# EAGLE design REL8 (EAGLE 5.06)
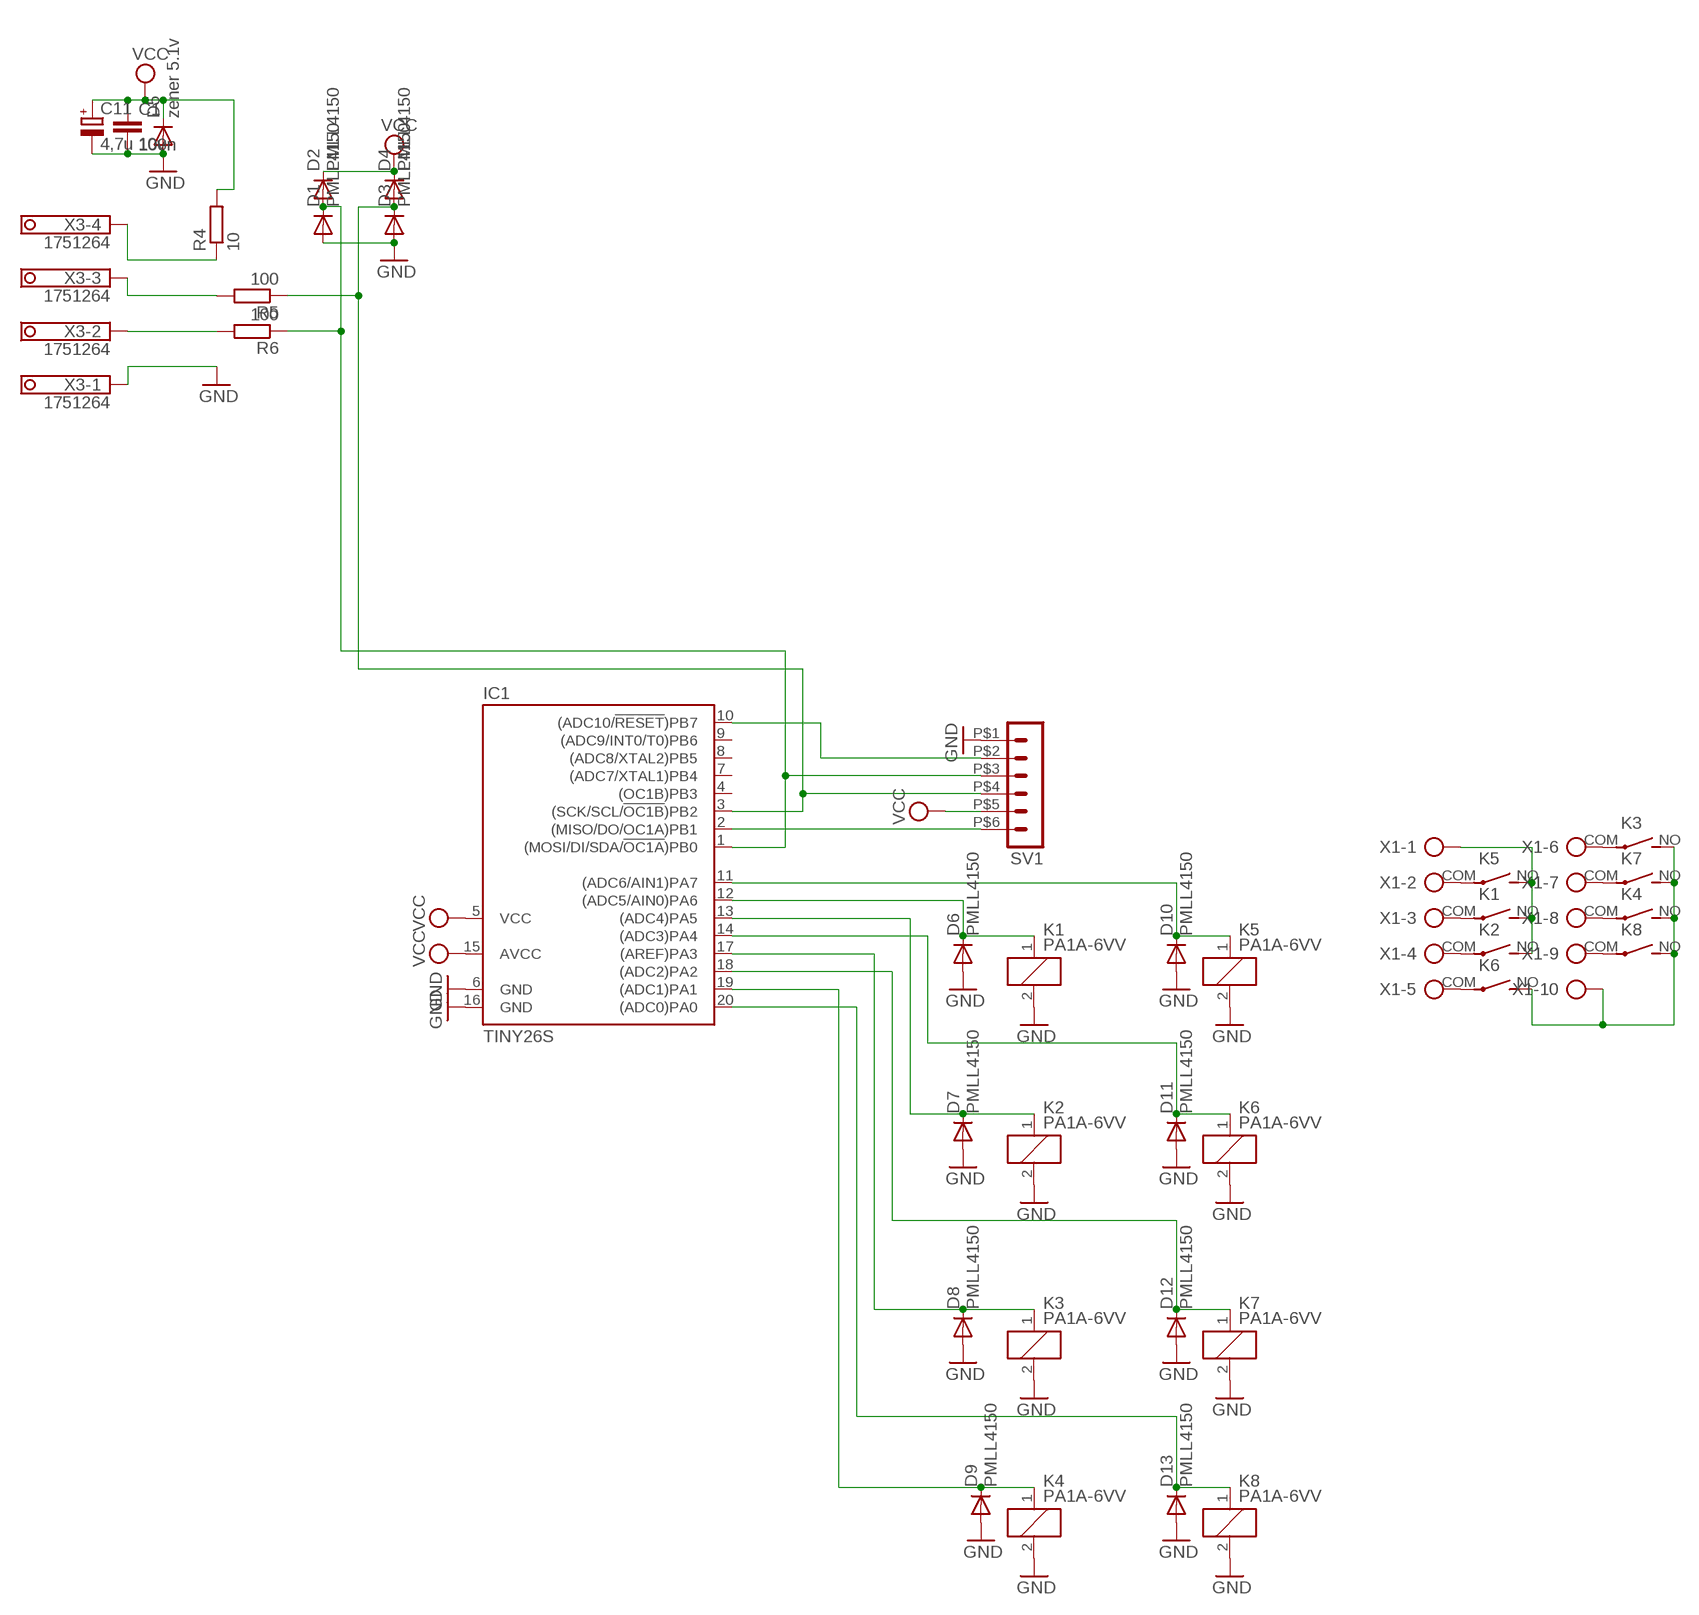
[diagram p0: schematic, sheet 1]

## Parts
C1  100n  C-EUC0805  [C0805]
C11  4,7u 10v  CPOL-EUB/3528-21R  [B/3528-21R]
D1  PMLL4150  [SOD80C]
D2  PMLL4150  [SOD80C]
D3  PMLL4150  [SOD80C]
D4  PMLL4150  [SOD80C]
D5  zener 5.1v  PMLL4150  [SOD80C]
D6  PMLL4150  [SOD80C]
D7  PMLL4150  [SOD80C]
D8  PMLL4150  [SOD80C]
D9  PMLL4150  [SOD80C]
D10  PMLL4150  [SOD80C]
D11  PMLL4150  [SOD80C]
D12  PMLL4150  [SOD80C]
D13  PMLL4150  [SOD80C]
IC1  TINY26S  [SO20L]
K1  PA1A-6VV  [PA]
K2  PA1A-6VV  [PA]
K3  PA1A-6VV  [PA]
K4  PA1A-6VV  [PA]
K5  PA1A-6VV  [PA]
K6  PA1A-6VV  [PA]
K7  PA1A-6VV  [PA]
K8  PA1A-6VV  [PA]
R4  10  R-EU_R0805  [R0805]
R5  100  R-EU_R0805  [R0805]
R6  100  R-EU_R0805  [R0805]
SV1  MA06-1'  [MA06-1_SMD_MINI]
X1  AK500/10  [AK500/10]
X3  1751264  [1751264]

## Nets
GND: C1.2 C11.- D1.A D3.A D5.A D6.A D7.A D8.A D9.A D10.A D11.A D12.A D13.A IC1.6(GND) IC1.16(GND) K1.2 K2.2 K3.2 K4.2 K5.2 K6.2 K7.2 K8.2 SV1.P$1 X3.1
MISO: D1.C D2.A IC1.1((MOSI/DI/SDA/!OC1A!)PB0) R6.1 SV1.P$3
N$1: K1.COM(2:P) X1.3
N$2: K5.COM(2:P) X1.2
N$3: K2.COM(2:P) X1.4
N$4: K1.NO(2:S) K2.NO(2:S) K5.NO(2:S) X1.1
N$5: K6.COM(2:P) X1.5
N$6: K3.COM(2:P) X1.6
N$7: K7.COM(2:P) X1.7
N$8: K4.COM(2:P) X1.8
N$9: IC1.10((ADC10/!RESET!)PB7) SV1.P$2
N$10: D6.C IC1.12((ADC5/AIN0)PA6) K1.1
N$11: D7.C IC1.13((ADC4)PA5) K2.1
N$12: D10.C IC1.11((ADC6/AIN1)PA7) K5.1
N$13: D11.C IC1.14((ADC3)PA4) K6.1
N$14: K8.COM(2:P) X1.9
N$15: D12.C IC1.18((ADC2)PA2) K7.1
N$16: R6.2 X3.2
N$17: R5.2 X3.3
N$18: R4.1 X3.4
N$19: K3.NO(2:S) K4.NO(2:S) K6.NO(2:S) K7.NO(2:S) K8.NO(2:S) X1.10
N$20: D13.C IC1.20((ADC0)PA0) K8.1
N$24: D8.C IC1.17((AREF)PA3) K3.1
N$27: D9.C IC1.19((ADC1)PA1) K4.1
N$28: IC1.2((MISO/DO/OC1A)PB1) SV1.P$6
SCK: D3.C D4.A IC1.3((SCK/SCL/!OC1B!)PB2) R5.1 SV1.P$4
VCC: C1.1 C11.+ D2.C D4.C D5.C IC1.5(VCC) IC1.15(AVCC) R4.2 SV1.P$5
Unconnected: IC1.4((OC1B)PB3) IC1.7((ADC7/XTAL1)PB4) IC1.8((ADC8/XTAL2)PB5) IC1.9((ADC9/INT0/T0)PB6)

## Library data of the parts
C1 = rcl:C-EU: CAPACITOR, European symbol
C11 = rcl:CPOL-EU: POLARIZED CAPACITOR, European symbol
D1-D13 = diode:PMLL4150: DIODE high speed
IC1 = atmel:TINY26*: 8-bit AVR Microcontroller with 2K Bytes Flash Source: http://www.atmel.com .. doc1477.pdf
K1-K8 = relay:PA?*: SLIM POWER RELAY NAiS Source: http://www.mew-europe.com/.. en_ds_61123_0000.pdf
R4-R6 = rcl:R-EU_: RESISTOR, European symbol
SV1 = con-lstb:MA06-1: PIN HEADER
X1 = con-ptr500:AK500/10: CONNECTOR
X3 = con-phoenix-350:1751264: MKDS 1/ 4-3,5 Printklemme Nennstrom: 10 A Bemessungsspannung: 160 V Raster: 3,5 mm Polzahl: 4 Montageart: Löten Anschlussart: Schraubanschluss Anschlussrichtung vom Leiter zur Platine: 0° Source: http://eshop.phoenixcontact.com .. 1751264.pdf

## Board
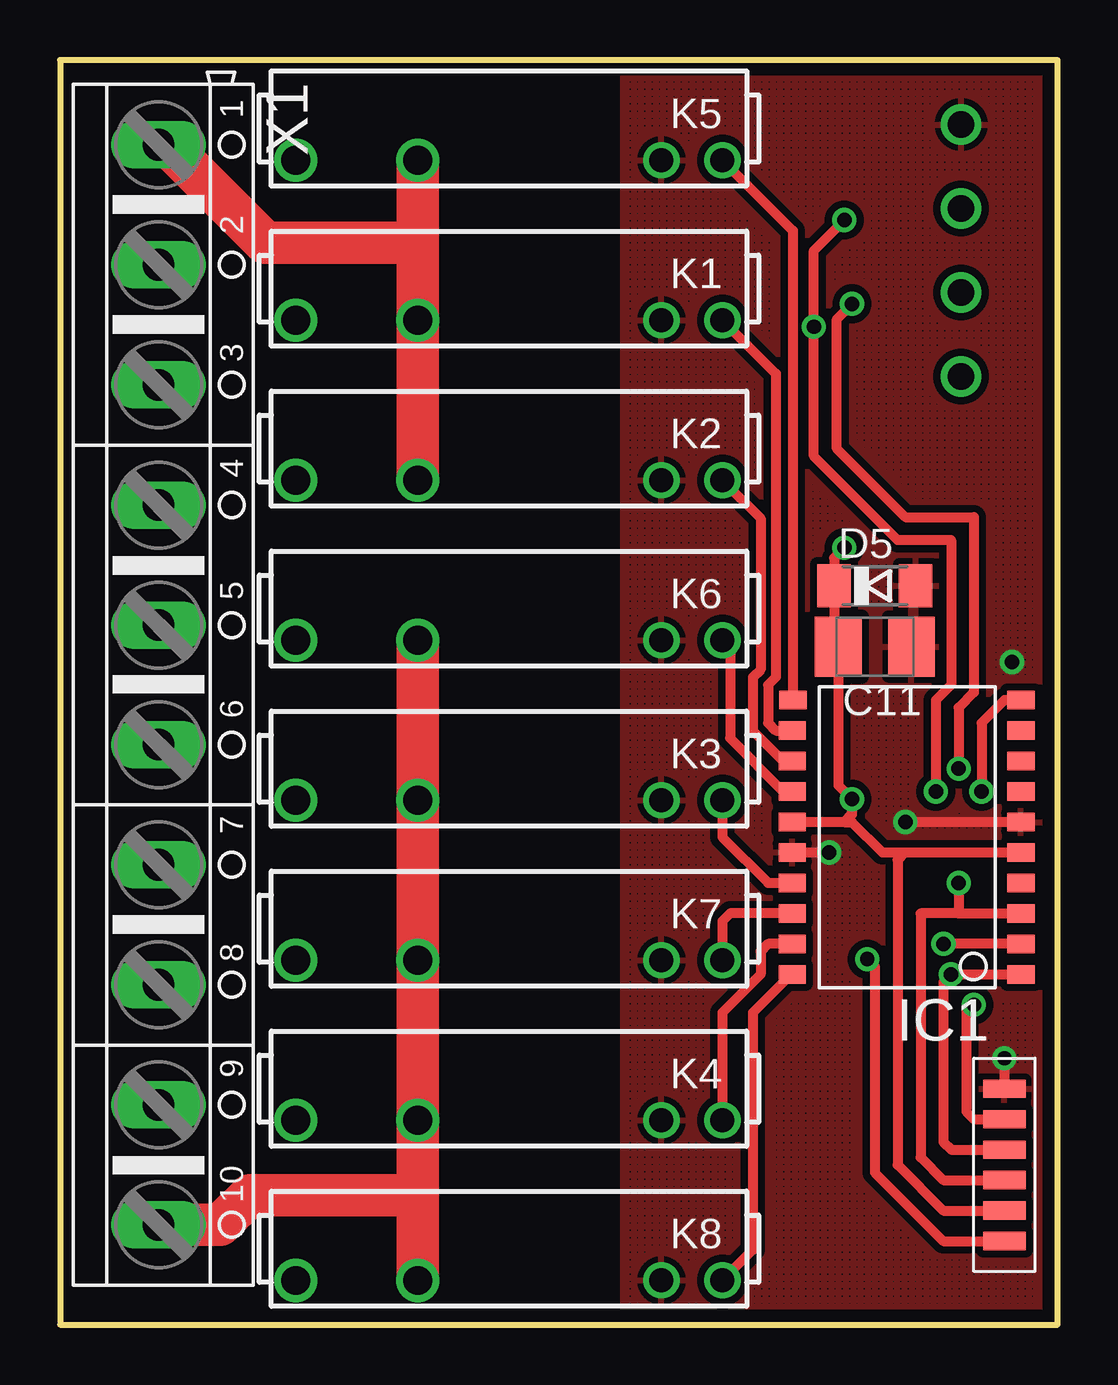
[diagram p1: board, top side]
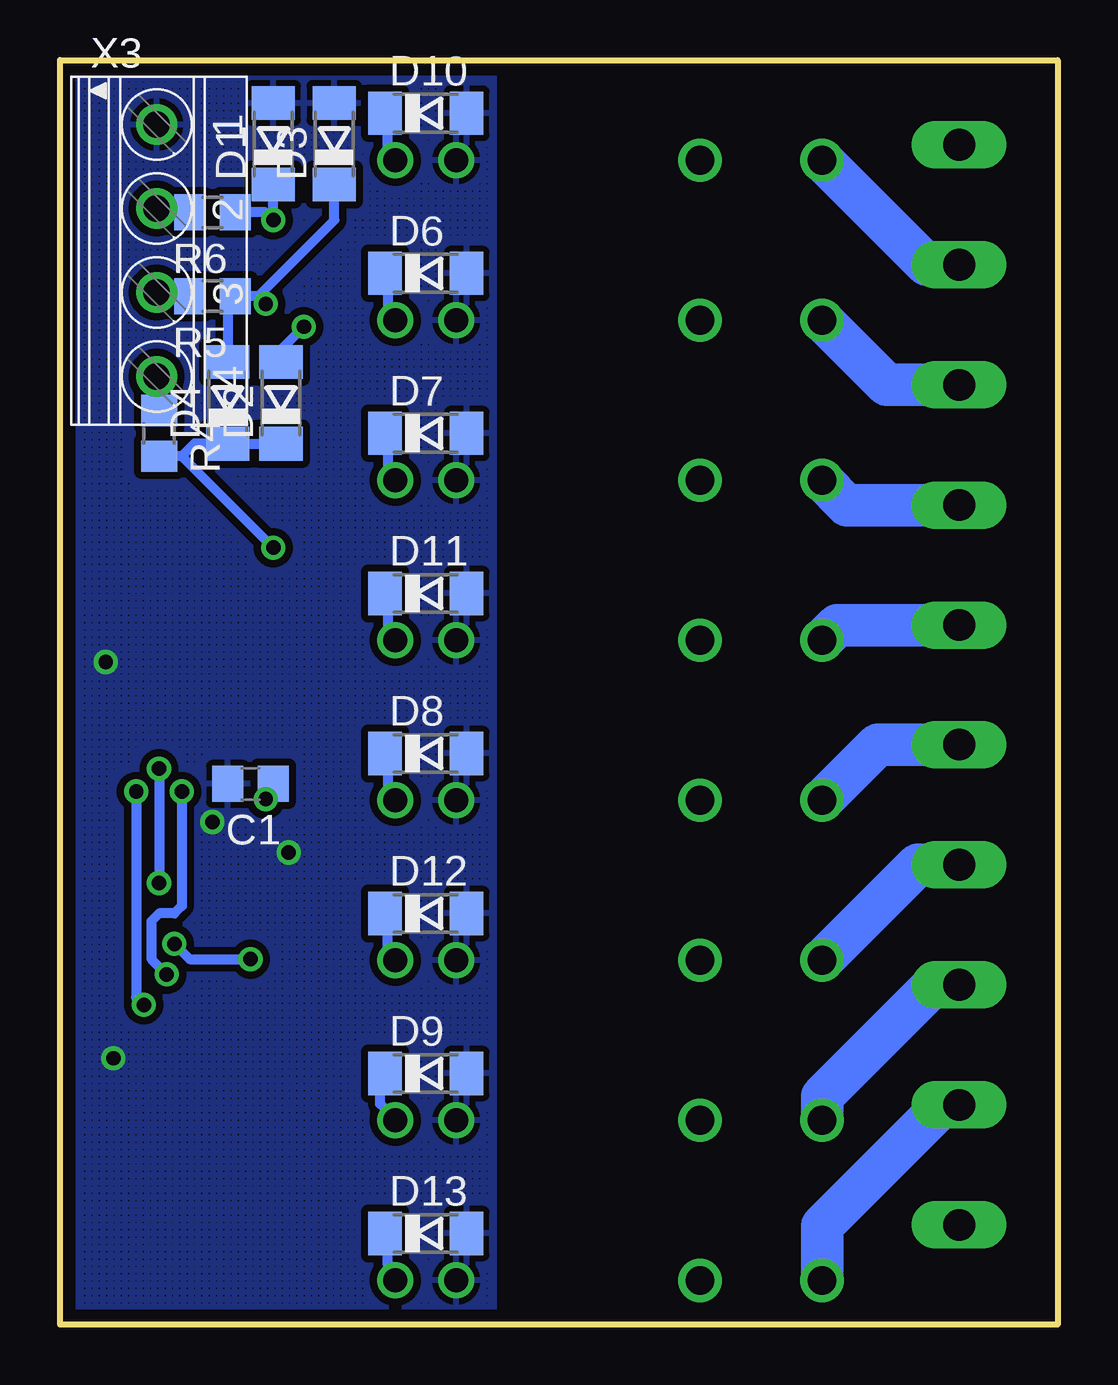
[diagram p2: board, bottom side, seen from below]

Size 41.57 x 52.69 mm. Coordinates in mm from the lower left corner, seen from the top.
Outline: 41.57,52.69 0,52.69 0,0 41.57,0 41.57,52.69
Copper layers (1*16): Top 0.035mm / dielectric 1.5mm / Bottom 0.035mm
Design rules "default *": minimum track width 10mil, minimum drill 16mil, track to track 8mil, track to pad 8mil, pad to pad 8mil, via to via 8mil, smd to smd 0mil, copper to edge 20mil, drill to drill 8mil, minimum pad ring 10mil, minimum via ring 8mil, stop-mask expansion 4mil, vias tented up to drill 0mil, thermal gap 10mil

### Footprints (pad centres in the part's own frame; a part is rotated, then mirrored left to right if it is on the bottom)
C0805 = smd 1.3 x 1.5: 1 -0.95,0; 2 0.95,0
B/3528-21R = smd 1.95 x 2.5: + 1.525,0; - -1.525,0
SOD80C = smd 1.4 x 1.8: A 1.7,0; C -1.7,0
SO20L = smd 0.762 x 1.143: 1 -5.08,-5.131; 2 -3.81,-5.131; 3 -2.54,-5.131; 4 -1.27,-5.131; 5 0,-5.131; 6 1.27,-5.131; 7 2.54,-5.131; 8 3.81,-5.131; 9 5.08,-5.131; 10 6.35,-5.131; 11 6.35,4.369; 12 5.08,4.394; 13 3.81,4.394; 14 2.54,4.394; 15 1.27,4.394; 16 0,4.394; 17 -1.27,4.394; 18 -2.54,4.394; 19 -3.81,4.394; 20 -5.08,4.394
PA = drill 1 round: 1 -8.89,1.32; 2 -6.35,1.32 | drill 1.2 round: COM 8.89,1.32; NO 3.81,1.32
R0805 = smd 1.3 x 1.5: 1 -0.95,0; 2 0.95,0
MA06-1_SMD_MINI = smd 0.762 x 1.778: P$1 -3.81,0; P$2 -2.54,0; P$3 -1.27,0; P$4 0,0; P$5 1.27,0; P$6 2.54,0
AK500/10 = drill 1.321 long: 1 -22.504,0; 2 -17.501,0; 3 -12.497,0; 4 -7.493,0; 5 -2.489,0; 6 2.489,0; 7 7.493,0; 8 12.497,0; 9 17.501,0; 10 22.504,0
1751264 = drill 1.1 pad 1.7 round: 1 -5.25,-0.1; 2 -1.75,-0.1; 3 1.75,-0.1; 4 5.25,-0.1

### Placement (x,y rotation side)
C1  33.63,22.53 180 bottom
C11  33.95,28.25 180 top
D1  32.68,49.2 90 bottom
D2  32.36,38.41 90 bottom
D3  30.14,49.2 90 bottom
D4  34.59,38.41 90 bottom
D5  33.95,30.79 0 top
D6  26.33,43.8 0 bottom
D7  26.33,37.14 0 bottom
D8  26.33,23.8 0 bottom
D9  26.33,10.46 0 bottom
D10  26.33,50.47 0 bottom
D11  26.33,30.47 0 bottom
D12  26.33,17.13 0 bottom
D13  26.33,3.8 0 bottom
IC1  34.9,19.67 90 top
K1  18.71,43.17 180 top
K2  18.71,36.5 180 top
K3  18.71,23.17 180 top
K4  18.71,9.83 180 top
K5  18.71,49.84 180 top
K6  18.71,29.83 180 top
K7  18.71,16.5 180 top
K8  18.71,3.16 180 top
R4  37.44,37.14 270 bottom
R5  35.22,42.85 180 bottom
R6  35.22,46.34 180 bottom
SV1  39.35,6.02 270 top
X1  4.11,26.66 270 top
X3  37.44,44.76 270 bottom

### Tracks (layer width: path | path; a pad name or v marks a point on that pad's centre or on a via)
GND  (via drill 0.6)
  Top 0.406: IC1.16 v32.05,19.67 | IC1.6 v35.22,20.94 | v39.35,11.1 SV1.P$1
  other vias: 39.67,27.61
  pour Top (isolate 0.305, hatched): 23.47,52.69 41.57,52.69 41.57,-0.01 23.47,-0.01
  pour Bottom (isolate 0.305, hatched): 23.47,52.69 41.57,52.69 41.57,-0.01 23.47,-0.01
MISO  (via drill 0.6)
  Top 0.406: SV1.P$3 37.13,7.29 36.81,7.61 36.81,14.28 v37.13,14.59 IC1.1 | v32.68,46.03 31.41,44.76 v31.41,41.58 31.41,36.18 34.9,32.69 37.13,32.69 37.13,26.66 36.49,26.02 v36.49,22.21
  Bottom 0.406: R6.1 33,46.34 v32.68,46.03 D1.C | D2.A 32.37,40.63 v31.41,41.58 | v36.49,22.21 36.49,17.45 36.81,17.13 37.44,17.13 37.76,16.82 37.76,15.23 v37.13,14.59
N$1
  Bottom 1.778: X1.3 7.13,39.15 K1.COM
N$2
  Bottom 1.778: X1.2 5.47,44.16 K5.COM
N$3
  Bottom 1.778: X1.4 8.79,34.15 K2.COM
N$4
  Top 1.778: X1.1 4.46,49.16 8.55,45.07 14.9,45.07 | K5.NO 14.9,45.07 | K2.NO K1.NO 14.9,45.07
N$5
  Bottom 1.778: X1.5 9.19,29.15 K6.COM
N$6
  Bottom 1.778: X1.6 7.5,24.17 K3.COM
N$7
  Bottom 1.778: X1.7 5.84,19.16 K7.COM
N$8
  Bottom 1.778: X1.8 5.17,14.16 9.82,9.51 K4.COM
N$9  (via drill 0.6)
  Top 0.406: SV1.P$2 38.08,8.56 37.76,8.88 37.76,11.42 37.76,13.32 v38.08,13.32 | v38.4,22.21 38.4,25.07 39.35,26.02 IC1.10
  Bottom 0.406: v38.08,13.32 38.4,13.64 v38.4,22.21
N$10
  Top 0.406: IC1.12 29.83,24.75 29.51,25.07 29.51,26.66 29.83,26.97 29.83,39.62 K1.1
  Bottom 0.406: K1.1 27.6,41.9 27.92,42.22 27.92,43.69 D6.C
N$11
  Top 0.406: IC1.13 30.14,23.48 28.87,24.75 28.87,26.97 29.19,27.29 29.19,33.59 K2.1
  Bottom 0.406: K2.1 27.6,35.23 27.92,35.55 27.92,37.02 D7.C
N$12
  Top 0.406: IC1.11 30.54,45.58 K5.1
  Bottom 0.406: K5.1 27.6,48.56 27.92,48.88 27.92,50.36 D10.C
N$13
  Top 0.406: IC1.14 30.14,22.21 27.92,24.43 27.92,28.2 K6.1
  Bottom 0.406: K6.1 27.6,28.56 27.92,28.88 27.92,30.36 D11.C
N$14
  Bottom 1.778: X1.9 4.78,9.16 9.82,4.12 K8.COM
N$15
  Top 0.406: IC1.18 27.92,17.13 27.6,16.82 K7.1
  Bottom 0.406: K7.1 27.6,15.23 27.92,15.54 27.92,17.02 D12.C
N$16
  Bottom 0.406: R6.2 37.38,46.34 X3.2
N$17
  Bottom 0.406: R5.2 37.39,42.85 X3.3
N$18
  Bottom 0.406: R4.1 37.44,39.41 X3.4
N$19
  Top 1.778: X1.10 6.69,4.15 7.92,5.39 14.9,5.39 | 14.9,5.39 K8.NO | 14.9,5.39 K4.NO K7.NO K3.NO K6.NO
N$20
  Top 0.406: IC1.20 30.46,14.59 28.87,13 28.87,3.11 K8.1
  Bottom 0.406: K8.1 27.6,2.21 27.92,2.53 27.92,3.91 | 27.92,3.91 27.92,4.43 | 27.92,3.91 D13.C
N$24
  Top 0.406: IC1.17 29.51,18.4 27.6,20.31 K3.1
  Bottom 0.406: K3.1 27.6,21.89 27.92,22.21 27.92,23.69 D8.C
N$27
  Top 0.406: IC1.19 29.51,15.86 29.19,15.54 29.19,14.59 27.6,13 K4.1
  Bottom 0.406: K4.1 27.6,8.56 28.24,9.2 28.24,10.26 D9.C
N$28  (via drill 0.6)
  Top 0.406: SV1.P$6 36.81,3.48 33.95,6.34 33.95,14.91 v33.64,15.23 | IC1.2 v36.81,15.86
  Bottom 0.406: v33.64,15.23 36.18,15.23 v36.81,15.86
SCK  (via drill 0.6)
  Top 0.406: SV1.P$4 36.81,6.02 35.86,6.97 35.86,17.13 37.44,17.13 | 37.44,17.13 IC1.3 | v33,42.53 32.37,41.9 32.37,36.5 35.22,33.64 38.08,33.64 38.08,26.34 37.44,25.71 v37.44,23.17 | v37.44,18.4 37.44,17.13
  Bottom 0.406: 33.32,42.85 R5.1 34.59,42.53 D4.A | v33,42.53 33.32,42.85 | v37.44,23.17 v37.44,18.4 | 33.32,42.85 30.14,46.03 D3.C
VCC  (via drill 0.6)
  Top 0.406: 32.68,20.94 33,20.94 34.27,19.67 35.22,19.67 | 32.68,20.94 IC1.15 | 35.22,19.67 IC1.5 | SV1.P$5 36.81,4.75 34.9,6.66 34.9,19.36 35.22,19.67 | 32.68,20.94 33,21.26 v33,21.89 32.43,22.47 C11.+ 32.25,28.42 D5.C 32.25,31.94 v32.68,32.37
  Bottom 0.406: C1.1 v33,21.9 v33,21.89 | 36.49,36.18 v32.68,32.37 | 36.49,36.18 R4.2 | D2.C D4.C 35.97,36.7 36.49,36.18